# Altium schematic sheet Supply.SchDoc
size A3
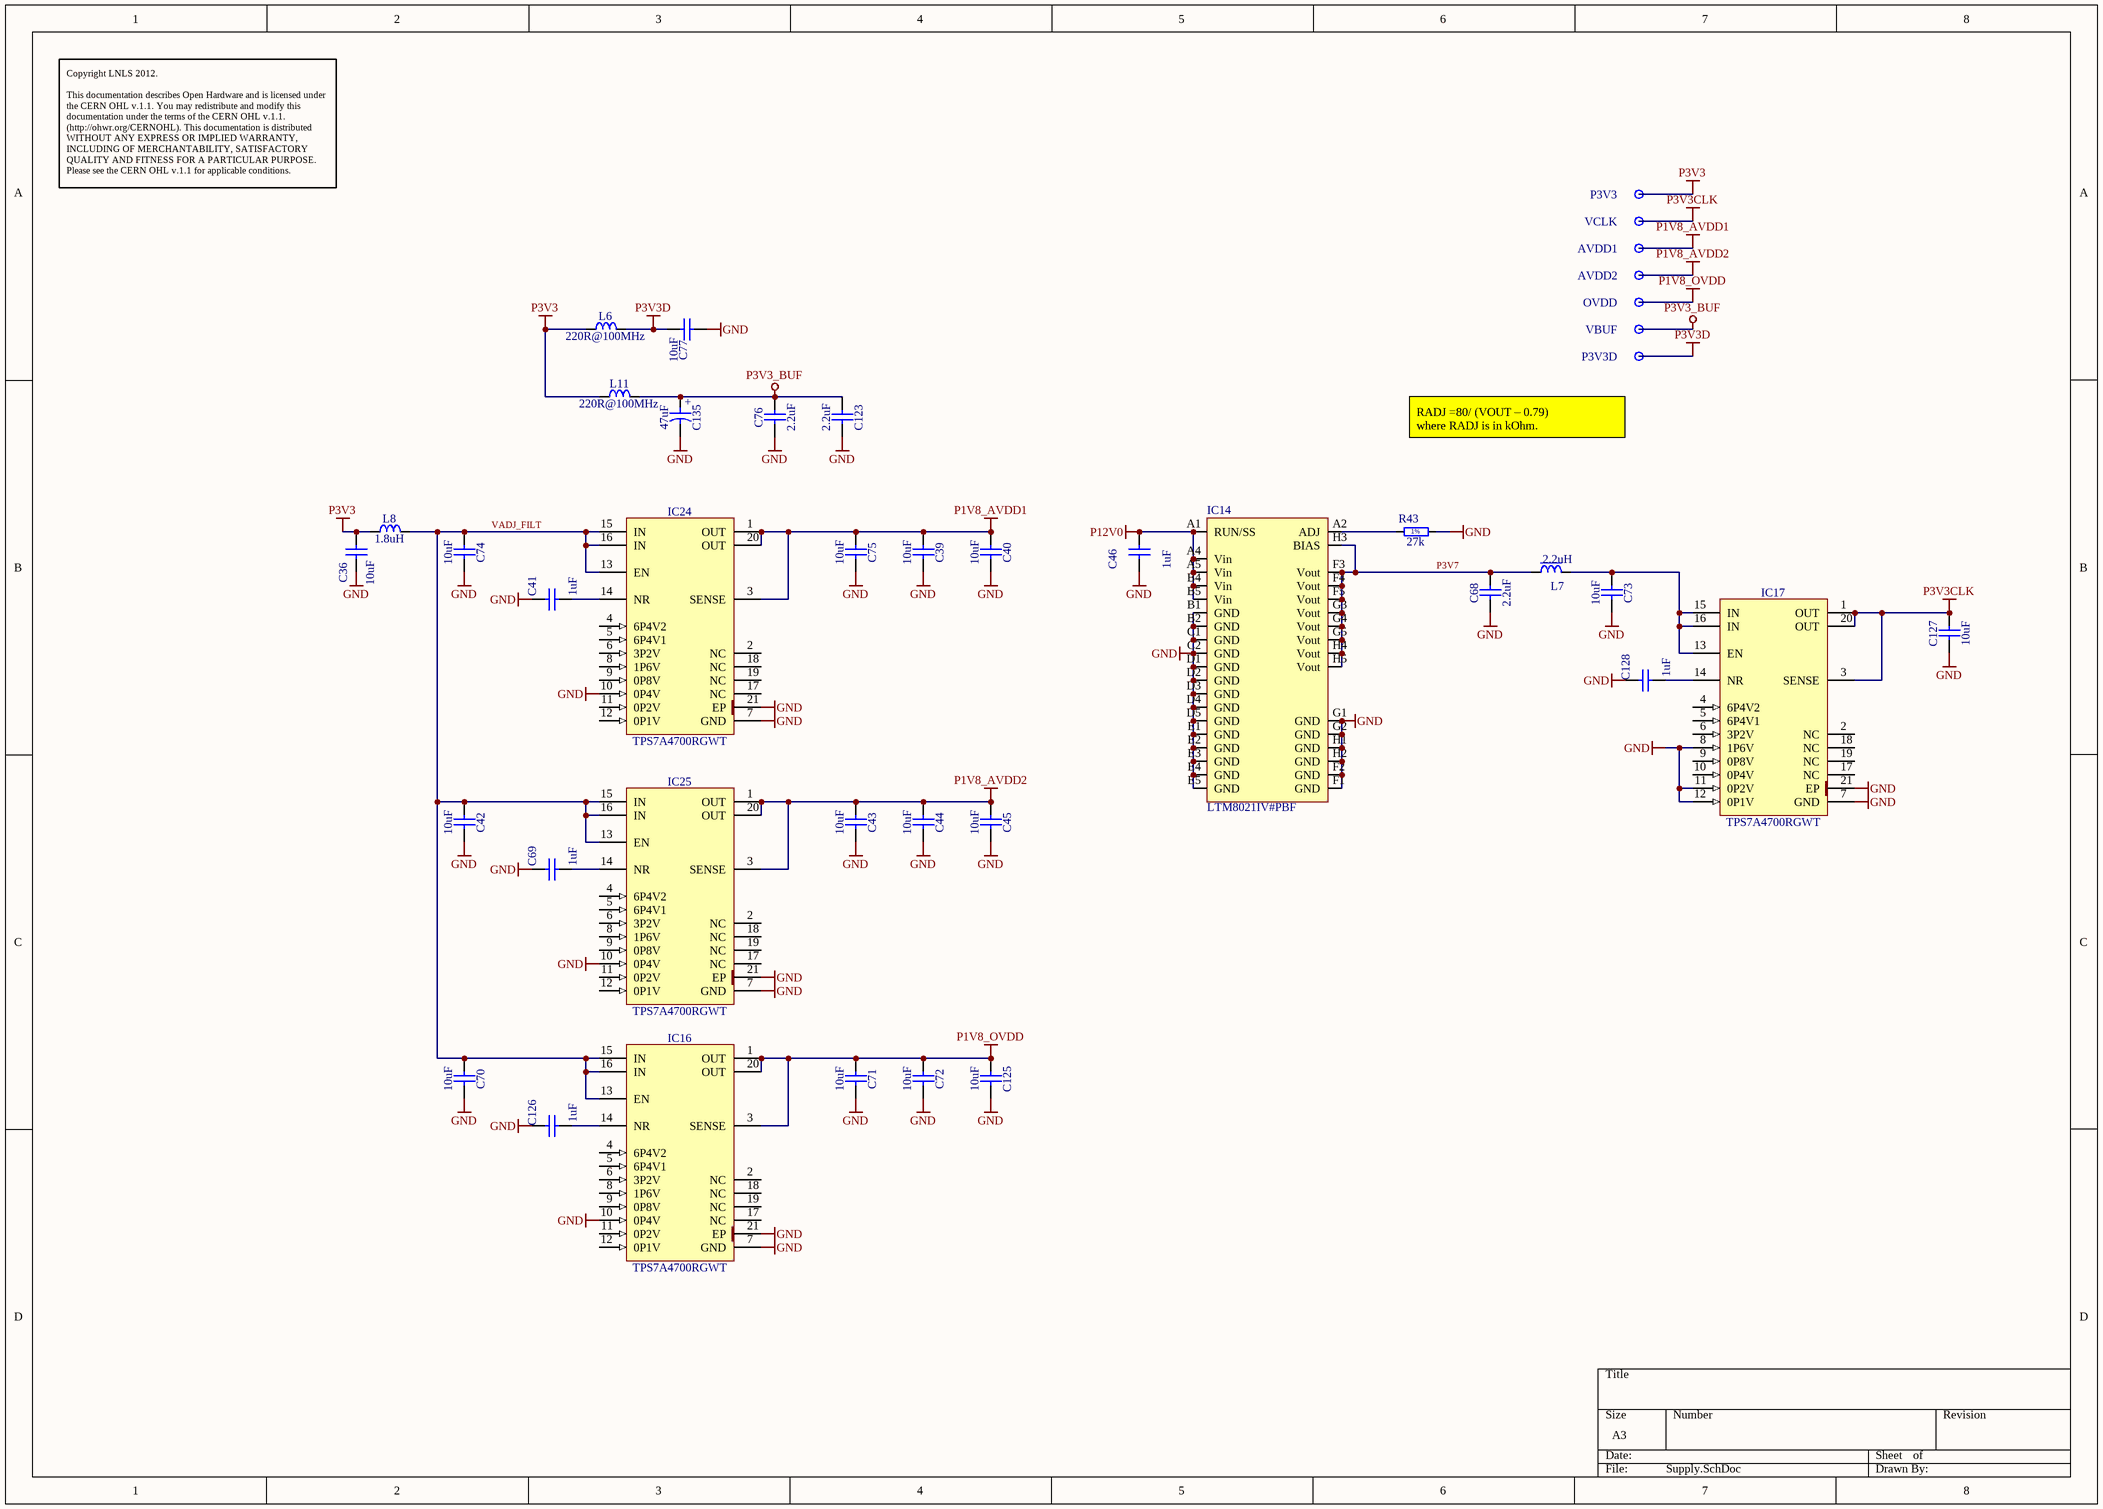
[diagram p0: Supply.SchDoc]

## Parts
AVDD1  Test Point  [TPS127]  (value not drawn)
AVDD2  Test Point  [TPS127]  (value not drawn)
C36  10uF  [CAPC2012X135N]
C39  10uF  [CAPC2012X135N]
C40  10uF  [CAPC2012X135N]
C41  1uF  [CAPC1608X87N]
C42  10uF  [CAPC2012X135N]
C43  10uF  [CAPC2012X135N]
C44  10uF  [CAPC2012X135N]
C45  10uF  [CAPC2012X135N]
C46  1uF  [CAPC1608X87N]
C68  2.2uF  [CAPC2012X135N]
C69  1uF  [CAPC1608X87N]
C70  10uF  [CAPC2012X135N]
C71  10uF  [CAPC2012X135N]
C72  10uF  [CAPC2012X135N]
C73  10uF  [CAPC2012X135N]
C74  10uF  [CAPC2012X135N]
C75  10uF  [CAPC2012X135N]
C76  2.2uF  [CAPC2012X135N]
C77  10uF  [CAPC2012X135N]
C123  2.2uF  [CAPC2012X135N]
C125  10uF  [CAPC2012X135N]
C126  1uF  [CAPC1608X87N]
C127  10uF  [CAPC2012X135N]
C128  1uF  [CAPC1608X87N]
C135  47uF  [CAPMP3528X210N]
IC14  LTM8021IV#PBF  [LGA35S127P5X8_625x1125x292]
IC16  TPS7A4700RGWT  [QFN65P500X500X100-21N-S325]
IC17  TPS7A4700RGWT  [QFN65P500X500X100-21N-S325]
IC24  TPS7A4700RGWT  [QFN65P500X500X100-21N-S325]
IC25  TPS7A4700RGWT  [QFN65P500X500X100-21N-S325]
L6  220R@100MHz  [INDC2012X105N]
L7  2.2uH  [IND_PANASONIC_ELLVGG]
L8  1.8uH  [IND_TDK_VLCF4020-1-1.8uH]
L11  220R@100MHz  [INDC2012X105N]
OVDD  Test Point  [TPS127]  (value not drawn)
P3V3  Test Point  [TPS127]  (value not drawn)
P3V3D  Test Point  [TPS127]  (value not drawn)
R43  27k  [RESC1608X55N]
VBUF  Test Point  [TPS127]  (value not drawn)
VCLK  Test Point  [TPS127]  (value not drawn)

## Nets
GND: C36.2 C39.2 C40.2 C41.2 C42.2 C43.2 C44.2 C45.2 C46.2 C68.1 C69.2 C70.2 C71.2 C72.2 C73.2 C74.2 C75.2 C76.1 C77.2 C123.2 C125.2 C126.2 C127.1 C128.2 C135.2 IC14.B1(GND) IC14.B2(GND) IC14.C1(GND) IC14.C2(GND) IC14.D1(GND) IC14.D2(GND) IC14.D3(GND) IC14.D4(GND) IC14.D5(GND) IC14.E1(GND) IC14.E2(GND) IC14.E3(GND) IC14.E4(GND) IC14.E5(GND) IC14.F1(GND) IC14.F2(GND) IC14.G1(GND) IC14.G2(GND) IC14.H1(GND) IC14.H2(GND) IC16.7(GND) IC16.10(0P4V) IC16.21(EP) IC17.7(GND) IC17.8(1P6V) IC17.11(0P2V) IC17.12(0P1V) IC17.21(EP) IC24.7(GND) IC24.10(0P4V) IC24.21(EP) IC25.7(GND) IC25.10(0P4V) IC25.21(EP) R43.2
P1V8_AVDD1: AVDD1.1 C39.1 C40.1 C75.1 IC24.1(OUT) IC24.3(SENSE) IC24.20(OUT)
P1V8_AVDD2: AVDD2.1 C43.1 C44.1 C45.1 IC25.1(OUT) IC25.3(SENSE) IC25.20(OUT)
P1V8_OVDD: C71.1 C72.1 C125.1 IC16.1(OUT) IC16.3(SENSE) IC16.20(OUT) OVDD.1
P3V3: C36.1 L6.1 L8.1 L11.1 P3V3.1
P3V3_BUF: C76.2 C123.1 C135.1 L11.2 VBUF.1
P3V3CLK: C127.2 IC17.1(OUT) IC17.3(SENSE) IC17.20(OUT) VCLK.1
P3V3D: C77.1 L6.2 P3V3D.1
P12V0: C46.1 IC14.A1(RUN/SS) IC14.A4(Vin) IC14.A5(Vin) IC14.B4(Vin) IC14.B5(Vin)
P3V7: C68.2 IC14.F3(Vout) IC14.F4(Vout) IC14.F5(Vout) IC14.G3(Vout) IC14.G4(Vout) IC14.G5(Vout) IC14.H3(BIAS) IC14.H4(Vout) IC14.H5(Vout) L7.1
VADJ_FILT: C42.1 C70.1 C74.1 IC16.13(EN) IC16.15(IN) IC16.16(IN) IC24.13(EN) IC24.15(IN) IC24.16(IN) IC25.13(EN) IC25.15(IN) IC25.16(IN) L8.2
NetC41_1: C41.1 IC24.14(NR)
NetC69_1: C69.1 IC25.14(NR)
NetC73_1: C73.1 IC17.13(EN) IC17.15(IN) IC17.16(IN) L7.2
NetC126_1: C126.1 IC16.14(NR)
NetC128_1: C128.1 IC17.14(NR)
NetIC14_A2: IC14.A2(ADJ) R43.1

Not connected (* = marked no-connect by the designer): IC16 2(NC) 4(6P4V2) 5(6P4V1) 6(3P2V) 8(1P6V) 9(0P8V) 11(0P2V) 12(0P1V) 17(NC) 18(NC) 19(NC); IC17 2(NC) 4(6P4V2) 5(6P4V1) 6(3P2V) 9(0P8V) 10(0P4V) 17(NC) 18(NC) 19(NC); IC24 2(NC) 4(6P4V2) 5(6P4V1) 6(3P2V) 8(1P6V) 9(0P8V) 11(0P2V) 12(0P1V) 17(NC) 18(NC) 19(NC); IC25 2(NC) 4(6P4V2) 5(6P4V1) 6(3P2V) 8(1P6V) 9(0P8V) 11(0P2V) 12(0P1V) 17(NC) 18(NC) 19(NC)

## Notes on the sheet
- Copyright LNLS 2012.
  This documentation describes Open Hardware and is licensed under the CERN OHL v.1.1. You may redistribute and modify this documentation under the terms of the CERN OHL v.1.1. (http://ohwr.org/CERNOHL). This documentation is distributed WITHOUT ANY EXPRESS OR IMPLIED WARRANTY, INCLUDING OF MERCHANTABILITY, SATISFACTORY QUALITY AND FITNESS FOR A PARTICULAR PURPOSE. Please see the CERN OHL v.1.1 for applicable conditions.
- (near P3V3D) RADJ =80/ (VOUT – 0.79)
  where RADJ is in kOhm.
- (in symbol CTE3528-21_47UF_6.3V_10%_LESR0250) +
- (in symbol R0603_27K_1%_0.1W_100PPM) 1%

## Library data of the parts
AVDD1 AVDD2 OVDD P3V3 P3V3D VBUF VCLK = SMD_PAD_1.27X1.27MM: Part Description: 1.27mm x 1.27mm PCB Copper Area (SMD Test Point); Mounted: No; Part Number: SMD_PAD_1.27X1.27MM; Component Kind: Standard (No BOM); Component Type: Standard (No BOM); Pin Count: 1; Family: Test Point; Socket: No; SMD: Yes; Sense: No; Status: None; ComponentHeight: 0mm; HelpURL: Undefined; Author: CERN DEM JLC; CreateDate: 12/01/2008; LatestRevisionDate: 12/01/2008; PackageDescription: 1.27mm x 1.27mm PCB Copper Area (SMD Test Point)
C36 C39 C40 C42-C45 C70-C75 C77 C125 C127 = CC0805_10UF_16V_10%_X5R: Non-polarised capacitor; Part Description: SMD Multilayer Chip Ceramic Capacitor; Manufacturer: GENERIC; Manufacturer1 Part Number: C0805C106K4PAC; Voltage: 16V; TC: X5R; Tolerance: ±10%; Part Number: CC0805_10UF_16V_10%_X5R; Component Kind: Standard; Component Type: Standard; Pin Count: 2; Value: 10uF; Status: Preferred; Manufacturer Part Number: CC0805_10UF_16V_10%_X5R; Case: 0805; Mounted: Yes; Socket: No; SMD: Yes; Sense: No; Manufacturer1 Example: KEMET; Manufacturer1 ComponentHeight: 1.4mm; HelpURL: \\cern.ch\dfs\Applications\Altium\Datasheets\CC1206_X5R_KEMET.pdf; Author: CERN DEM JLC; CreateDate: 03/12/2007; LatestRevisionDate: 03/12/2007
C41 C46 C69 C126 C128 = CC0603_1UF_16V_10%_X7R: Non-polarised capacitor; Part Description: SMD Multilayer Chip Ceramic Capacitor; Manufacturer: GENERIC; Manufacturer1 Part Number: 223878615663; Voltage: 16V; TC: X7R; Tolerance: ±10%; Part Number: CC0603_1UF_16V_10%_X7R; Component Kind: Standard; Component Type: Standard; Pin Count: 2; Value: 1uF; Status: None; Manufacturer Part Number: CC0603_1uF_16V_10%_X7R; Case: 0603; Mounted: Yes; Socket: No; SMD: Yes; Sense: No; Manufacturer1 Example: YAGEO PHYCOMP; Manufacturer1 ComponentHeight: 0.9mm; HelpURL: \\cern.ch\dfs\Applications\Altium\Datasheets\CC0603_X7R_PHYCOMP.pdf; Author: CERN DEM JLC; CreateDate: 03/12/2007; LatestRevisionDate: 17/04/2015
C68 C76 C123 = CC0805_2.2UF_16V_10%_X7R: Non-polarised capacitor; Part Description: SMD Multilayer Chip Ceramic Capacitor; Manufacturer: GENERIC; Manufacturer1 Part Number: GRM21BF51C225ZA01L; Voltage: 16V; TC: X7R; Tolerance: ±10%; Part Number: CC0805_2.2UF_16V_10%_X7R; Component Kind: Standard; Component Type: Standard; Pin Count: 2; Value: 2.2uF; Status: Preferred; Manufacturer Part Number: CC0805_2.2UF_16V_10%_X7R; Case: 0805; Mounted: Yes; Socket: No; SMD: Yes; Sense: No; Manufacturer1 Example: MURATA; Manufacturer1 ComponentHeight: 1.5mm; HelpURL: \\cern.ch\dfs\Applications\Altium\Datasheets\CC0805_X7R_MURATA_GRM.pdf; Author: CERN DEM JLC; CreateDate: 03/12/2007; LatestRevisionDate: 18/09/2014
C135 = CTE3528-21_47UF_6.3V_10%_LESR0250: Polarised capacitor; Part Description: Low ESR 0R25 Solid Tantalum Chip Capacitor; Manufacturer: GENERIC; Manufacturer1 Part Number: TPSB476K006R0250; Voltage: 6.3V; Tolerance: ±10%; Part Number: CTE3528-21_47UF_6.3V_10%_LESR0250; Component Kind: Standard; Component Type: Standard; Pin Count: 2; Value: 47uF; Status: Preferred; Manufacturer Part Number: CTE3528-21_47UF_6.3V_10%_LESR0250; Case: B; Mounted: Yes; Socket: No; SMD: Yes; Sense: No; Manufacturer1 Example: AVX; Manufacturer1 ComponentHeight: 2.1mm; HelpURL: \\cern.ch\dfs\Applications\Altium\Datasheets\CTE-LESR_AVX_TPS.pdf; Author: CERN DEM JLC; CreateDate: 05/05/2008; LatestRevisionDate: 20/01/2009
IC14 = LTM8021IV#PBF: 36VIN, 500mA  Step-Down DC/DC Module; Manufacturer: LINEAR TECHNOLOGY; PressFit: No; Bonding: No; Part Number: LTM8021IV#PBF; Component Kind: Standard; Component Type: Standard; Device: LTM8021IV#PBF; PackageDescription: LGA, 1.27mm pitch,rect.; 35 pin,5 columns X 8 rows, 6.25mm X 11.25mm X 2.92mm H; Part Description: 36VIN, 500mA  Step-Down DC/DC Module; Manufacturer Part Number: LTM8021IV#PBF; Pin Count: 35; Mounted: Yes; Socket: No; SMD: Yes; Sense: No; ComponentHeight: 2.92mm; Author: LNLS DIG GBMB; CreateDate: 28/05/2016; LatestRevisionDate: 28/05/2016
IC16 IC17 IC24 IC25 = TPS7A4700RGWT: Low Noise (3uVrms), 1A, High Voltage Low-Dropout Linear Regulator; Part Description: 1.4 V to 19.1 V, 1A, Low Noise (3uVrms), Low-Dropout Linear Regulator; Manufacturer: TEXAS INSTRUMENTS; Table: Regulators; Bonding: No; PressFit: No; Part Number: TPS7A4700RGWT; Component Kind: Standard; Component Type: Standard; Device: TPS7A4700RGWT; PackageDescription: QFN, 0.65mm pitch,square; 20 pin, 5mm X 5mm X 1mm H body (w/thermal tab 3.25 X 3.25mm),  IPC Medium Density; Manufacturer Part Number: TPS7A4700RGWT; Pin Count: 21; Case: QFN20; Mounted: Yes; Socket: No; SMD: Yes; ComponentHeight: 1mm; HelpURL: \\cern.ch\dfs\Applications\Altium\Datasheets\TPS7A4700RGWT.pdf; Author: CERN DEM JLC; CreateDate: 03/07/2012; LatestRevisionDate: 03/07/2012; Sense: No
L6 L11 = IND0805_MURATA_BLM21PG221SN1D: Inductor; Part Description: SMD EMIFIL Suppression Chip Ferrite Bead; Manufacturer: MURATA; Power: 2A; Resistance: 0.05R; Tolerance: ±25%; Table: Inductors SMD; Part Number: IND0805_MURATA_BLM21PG221SN1D; Component Kind: Standard; Component Type: Standard; Pin Count: 2; Value: 220R@100MHz; Status: None; Manufacturer Part Number: BLM21PG221SN1D; Case: 0805; Mounted: Yes; Socket: No; SMD: Yes; ComponentHeight: 1.05mm; HelpURL: \\cern.ch\dfs\Applications\Altium\Datasheets\IND0402_MURATA_BLM21P.pdf; Author: CERN DEM JLC; CreateDate: 25/01/2010; LatestRevisionDate: 25/01/2010; Sense: No
L7 = IND_2.2UH_30%_PANASONIC_ELLVGG2R2N: Inductor With Core; Part Description: Wire Wound SMD Power Inductor, G Series; Power: 1.4A; Resistance: 0.087R; Tolerance: ±30%; Part Number: IND_2.2UH_30%_PANASONIC_ELLVGG2R2N; Component Kind: Standard; Component Type: Standard; Pin Count: 2; Value: 2.2uH; Status: None; Manufacturer: PANASONIC; Manufacturer Part Number: ELLVGG2R2N; Mounted: Yes; Socket: No; SMD: Yes; Sense: No; ComponentHeight: 1.5mm; HelpURL: \\cern.ch\dfs\Applications\Altium\Datasheets\IND_PANASONIC_ELLVGG.pdf; Author: LNLS DIG GBMB; CreateDate: 31/05/2016; LatestRevisionDate: 31/05/2016
L8 = IND_1.8UH_30%_TDK_VLCF4020-1: Inductor; Part Description: SMD Inductor for Power Circuits (Wound/STD , Magnetic Shielded), VLCF series; Manufacturer: TDK; Manufacturer Part Number: VLCF4020T-1R8N1R9; Power: 1.9A; Resistance: 0.046; Tolerance: ±30%; Part Number: IND_1.8UH_30%_TDK_VLCF4020-1; Component Kind: Standard; Component Type: Standard; Pin Count: 2; Value: 1.8uH; Status: None; Mounted: Yes; Socket: No; SMD: Yes; Sense: No; ComponentHeight: 2mm; Author: LNLS DIG LOS; CreateDate: 09/05/2017; LatestRevisionDate: 09/05/2017
R43 = R0603_27K_1%_0.1W_100PPM: Resistor - 1%; Part Description: General Purpose Thick Film Chip Resistor; Manufacturer: GENERIC; Manufacturer1 Part Number: NRC06F2702TRF; Power: 0.1W; TC: ±100ppm/°C; Part Number: R0603_27K_1%_0.1W_100PPM; Component Kind: Standard; Component Type: Standard; Pin Count: 2; Value: 27k; Status: Preferred; Tolerance: ±1%; Manufacturer Part Number: R0603_27K_1%_0.1W_100PPM; Case: 0603; Mounted: Yes; Sense: No; Socket: No; SMD: Yes; Manufacturer1 Example: NIC COMPONENT; Manufacturer1 ComponentHeight: 0.55mm; HelpURL: \\cern.ch\dfs\Applications\Altium\Datasheets\R0603_NIC_NRC.pdf; Author: CERN DEM JLC; CreateDate: 03/12/2007; LatestRevisionDate: 13/03/2008